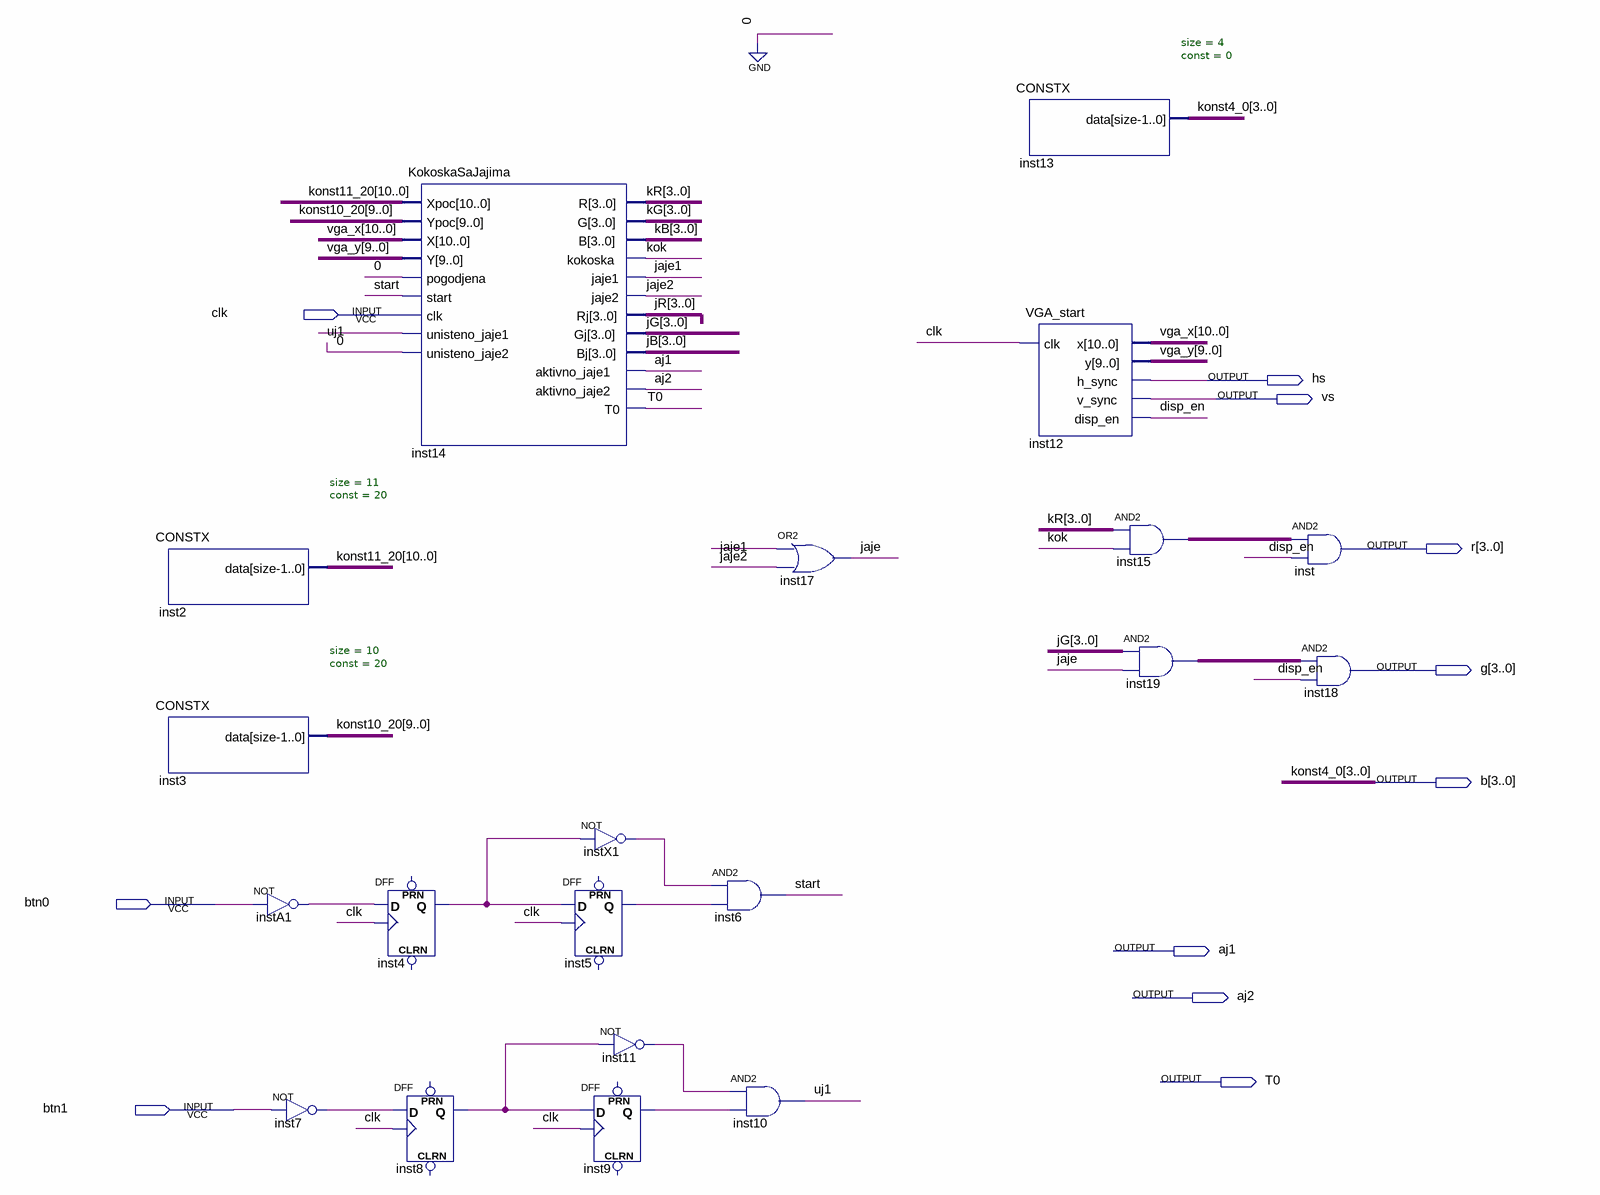
[diagram p0: schematic sheet]
// Quartus schematic testKokoskaSaJajima.bdf as structural Verilog: 20 symbols, 11 pins
module testKokoskaSaJajima (
  input  clk,
  input  btn0,
  input  btn1,
  output hs,
  output vs,
  output [3:0] r,
  output [3:0] g,
  output [3:0] b,
  output aj1,
  output aj2,
  output T0
);

  wire disp_en, inst4_q, inst5_q, inst7_out, inst8_q, inst9_q, inst11_out, instA1_out, instX1_out, jaje,
       jaje1, jaje2, kok, start, uj1;
  wire [3:0] inst15_out, inst19_out, jB, jG, jR, kB, kG, kR;
  wire [9:0] konst10_20, vga_y;
  wire [10:0] konst11_20, vga_x;

  CONSTX #(.size(11), .\const (20)) inst2 (.data(konst11_20));
  CONSTX #(.size(10), .\const (20)) inst3 (.data(konst10_20));
  not instA1 (instA1_out, btn0);
  not inst7 (inst7_out, btn1);
  KokoskaSaJajima inst14 (
    .Xpoc(konst11_20), .Ypoc(konst10_20), .X(vga_x), .Y(vga_y), .pogodjena(1'b0), .start(start), .clk(clk),
    .unisteno_jaje1(uj1), .unisteno_jaje2(1'b0), .R(kR), .G(kG), .B(kB), .kokoska(kok), .jaje1(jaje1),
    .jaje2(jaje2), .Rj(jR), .Gj(jG), .Bj(jB), .aktivno_jaje1(aj1), .aktivno_jaje2(aj2), .T0(T0));
  DFF inst4 (.CLK(clk), .D(instA1_out), .Q(inst4_q));  // open: CLRN, PRN
  DFF inst8 (.CLK(clk), .D(inst7_out), .Q(inst8_q));  // open: CLRN, PRN
  DFF inst5 (.CLK(clk), .D(inst4_q), .Q(inst5_q));  // open: CLRN, PRN
  not instX1 (instX1_out, inst4_q);
  not inst11 (inst11_out, inst8_q);
  DFF inst9 (.CLK(clk), .D(inst8_q), .Q(inst9_q));  // open: CLRN, PRN
  and inst6 (start, instX1_out, inst5_q);
  or inst17 (jaje, jaje1, jaje2);
  and inst10 (uj1, inst11_out, inst9_q);
  CONSTX #(.size(4), .\const (0)) inst13 (.data(b));
  VGA_start inst12 (.clk(clk), .x(vga_x), .y(vga_y), .h_sync(hs), .v_sync(vs), .disp_en(disp_en));
  assign inst15_out = kR & {4{kok}};  // AND2 inst15, 4 bits wide
  assign inst19_out = jG & {4{jaje}};  // AND2 inst19, 4 bits wide
  assign r = inst15_out & {4{disp_en}};  // AND2 inst, 4 bits wide
  assign g = inst19_out & {4{disp_en}};  // AND2 inst18, 4 bits wide

  // Other names for the same wires on the sheet: konst4_0[3:0] = b
endmodule
